# Altium schematic sheet MCU_LDO.SchDoc
size A4; Organization: Altium Limited; Address1: L3, 12a Rodborough Rd; Address2: Frenchs Forest; Address3: NSW; Address4: Australia 2086; DocumentNumber: 9; SheetNumber: 9; SheetTotal: 19
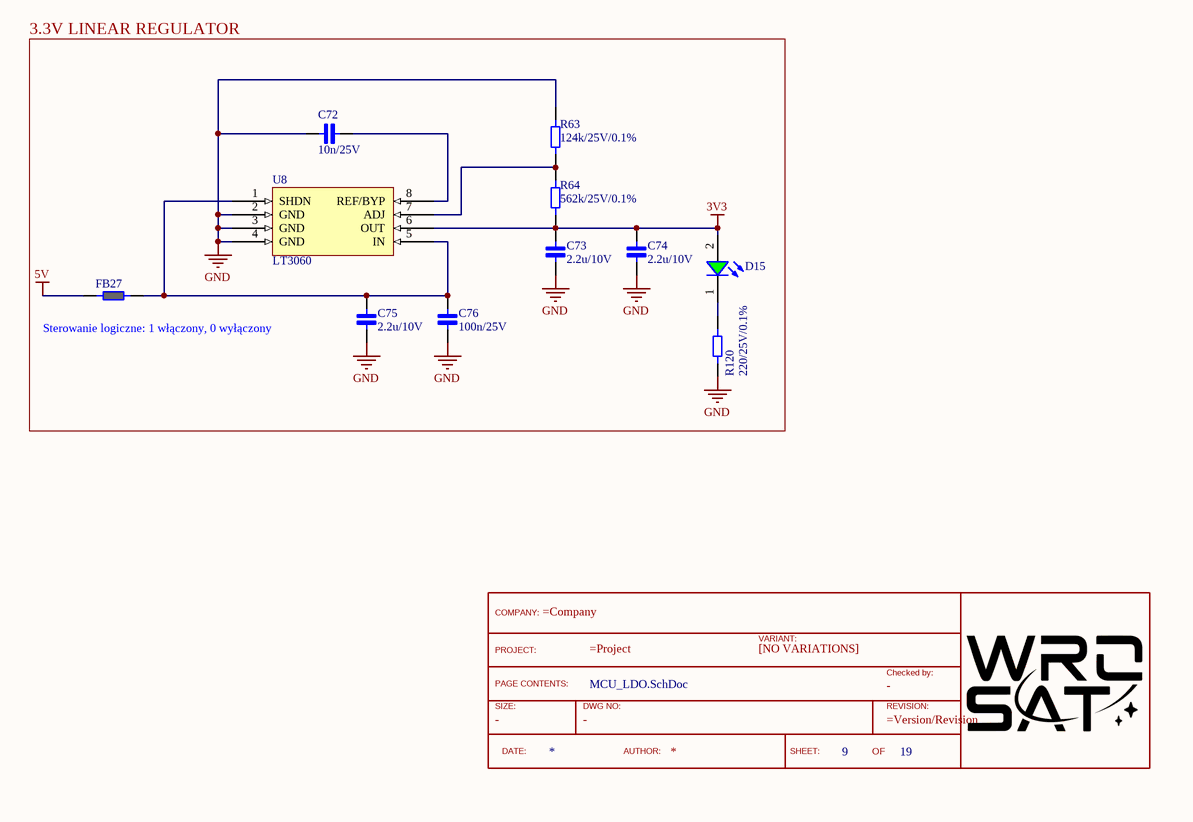
[diagram p0: MCU_LDO.SchDoc]

## Parts
?  TitleBlock  (value not drawn)  (graphical)
C72  10n/25V  [Cap_0402]
C73  2.2u/10V  [Cap_0402]
C74  2.2u/10V  [Cap_0402]
C75  2.2u/10V  [Cap_0402]
C76  100n/25V  [Cap_0402]
D15  Green, 3.2V  [WL-SMCW_0603_H=0.7mm]  (value not drawn)
FB27  Ferrite_bead_0402  [FERRITE_0402]  (value not drawn)
R63  124k/25V/0.1%  [RES_0402]
R64  562k/25V/0.1%  [RES_0402]
R120  220/25V/0.1%  [RES_0402]
U8  LT3060  [TS8]

## Blocks framed on the sheet
3.3V LINEAR REGULATOR: C72-C76 D15 FB27 R63 R64 R120 U8

## Nets
3V3: C73.2 C74.2 D15.2(A) R64.1 U8.6(OUT)
5V: FB27.1
GND: C72.1 C73.1 C74.1 C75.1 C76.1 R63.2 R120.1 U8.2(GND) U8.3(GND) U8.4(GND)
NetC72_2: C72.2 U8.8(REF/BYP)
NetC75_2: C75.2 C76.2 FB27.2 U8.1(SHDN) U8.5(IN)
NetD15_1: D15.1(K) R120.2
NetR63_1: R63.1 R64.2 U8.7(ADJ)

## Notes on the sheet
- (near FB27) Sterowanie logiczne: 1 włączony, 0 wyłączony
- Title
- Size:
- Date:
- A3
- Number:
- Time:
- Revision:
- Sheet
- of
- File:
- (in symbol TitleBlock) COMPANY:; VARIANT:; PROJECT:; [NO VARIATIONS]; Checked by:; PAGE CONTENTS:; SIZE:; DWG NO:; REVISION:; DATE:; AUTHOR:; SHEET:; OF

## Library data of the parts
? = TitleBlock: Standard TitleBlock; DrawingNo: -; Size: -; Checked: -
C72 = Cap_0402_10n: Ceramic Capacitor 10n / 0402 / 25V / ±5%, Wurth Elektronik MLCC; ComponentLink1Description: New link; ComponentLink1URL: https://www.we-online.com/catalog/en/WCAP-CSGP-25VDC
C73-C75 = Cap_0402_2.2u: Ceramic Capacitor 2.2uF / 0402 / 10V / ±5%, Wurth Elektronik MLCC
C76 = Cap_0402_100n: Ceramic Capacitor 100n / 0402 / 25V / ±5%, Wurth Elektronik MLCC; ComponentLink1Description: New link; ComponentLink1URL: https://www.we-online.com/catalog/en/WCAP-CSGP-25VDC
D15 = 150060GS75000: WL-SMCW SMT Mono-color Chip LED Waterclear, size 0603, Green, 3.2V, 140deg; Chip Technology: InGaN; Dominant Wavelength typ.: 525nm; Luminous Intensity typ.: 430mcd; Peak Wavelength typ.: 515nm; Viewing Angle: 140deg; ComponentLink1Description: Manufacturer; ComponentLink1URL: http://www.we-online.de; ComponentLink2URL: https://www.we-online.com/catalog/datasheet/150060GS75000.pdf; ComponentLink2Description: Datasheet; Forward Voltage typ.: 3.2V; Emitting Color: Green; Mounting Technology: SMT; Operating Temperature: -40 to +85degC; Published Date: December 2019; Part Number: 150060GS75000; Packaging: Tape and Reel; Size: 0603; Publisher: Wurth Elektronik
FB27 = Ferrite_bead_0402: Ferrite bead, wurth 74269241102
R63 = Res_0402_124k: Vishay, thin film resistor 124k/25V/0.1%
R64 = Res_0402_562k: Vishay, thin film resistor 562k/25V/0.1%
R120 = Res_0402_1: Vishay, thin film resistor 1/25V/0.1%
U8 = Lt3060: 45V VIN, Micropower, / Low Noise, 100mA Low / Dropout, Linear Regulator